# Altium schematic sheet Sheet1.SchDoc
size A4
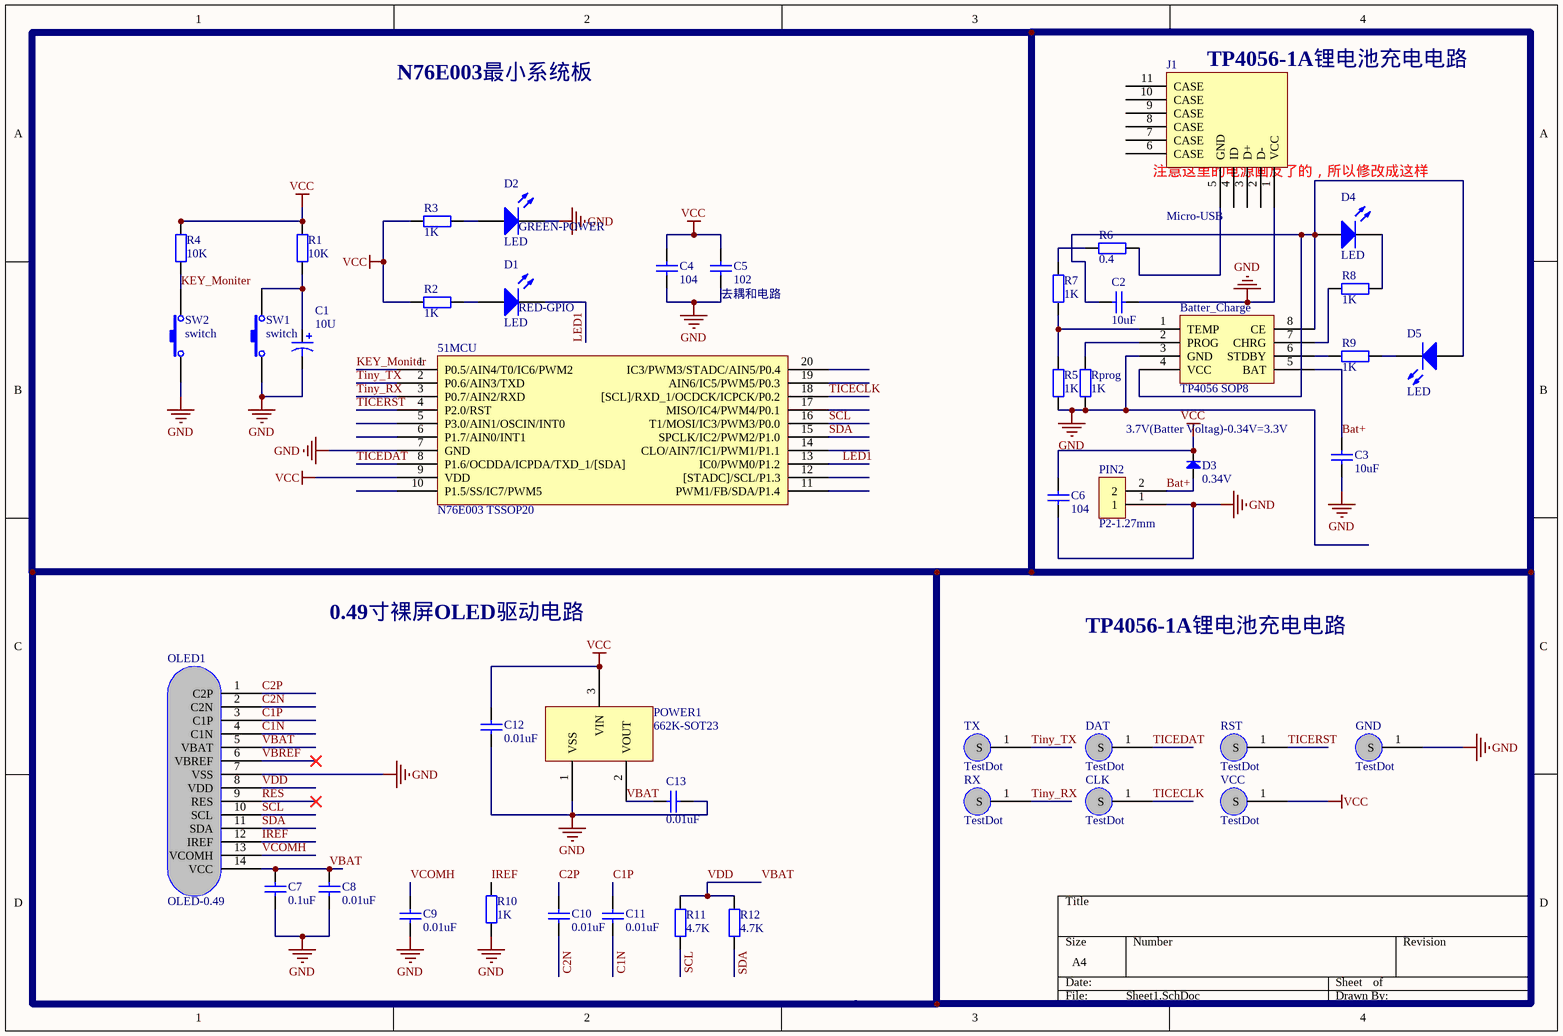
[diagram p0: Sheet1.SchDoc]

## Parts
51MCU  N76E003 TSSOP20  [TSSOP20]
Batter_Charge  TP4056 SOP8  [SOP8]
C1  10U  [0805P]
C2  10uF  [0603C]
C3  10uF  [0603C]
C4  104  [0603C]
C5  102  [0603C]
C6  104  [0603C]
C7  0.1uF  [CAP_0402_SMD]
C8  0.01uF  [CAP_0402_SMD]
C9  0.01uF  [CAP_0402_SMD]
C10  0.01uF  [CAP_0402_SMD]
C11  0.01uF  [CAP_0402_SMD]
C12  0.01uF  [CAP_0402_SMD]
C13  0.01uF  [CAP_0402_SMD]
CLK  TestDot  [Single-Dot]
D1  LED  [0805P]
D2  LED  [0805P]
D3  0.34V  [1206D]
D4  LED  [0805P]
D5  LED  [0805P]
DAT  TestDot  [Single-Dot]
GND  TestDot  [Single-Dot]
J1  Micro-USB  [Micro-USB]
OLED1  OLED-0.49  [OLED-0.49]
PIN2  P2-1.27mm  [Pin2-1.27mm]
POWER1  662K-SOT23  [SOT-23]
R1  10K  [RES_0402_SMD]
R2  1K  [RES_0402_SMD]
R3  1K  [RES_0402_SMD]
R4  10K  [RES_0402_SMD]
R5  1K  [0402]
R6  0.4  [0402]
R7  1K  [0402]
R8  1K  [0402]
R9  1K  [0402]
R10  1K  [RES_0402_SMD]
R11  4.7K  [RES_0402_SMD]
R12  4.7K  [RES_0402_SMD]
Rprog  1K  [0402]
RST  TestDot  [Single-Dot]
RX  TestDot  [Single-Dot]
SW1  switch  [SWITCH-微型]
SW2  switch  [SWITCH-微型]
TX  TestDot  [Single-Dot]
VCC  TestDot  [Single-Dot]

## Nets
GND: 51MCU.7(GND) Batter_Charge.3(GND) C1.2 C2.2 C3.1 C4.1 C5.1 C6.1 C7.1 C8.2 C9.2 C12.2 C13.2 D2.2(K) GND.1(S) J1.1(VCC) OLED1.7(VSS) PIN2.1 POWER1.1(VSS) R5.1 R10.1 Rprog.1 SW1.1 SW2.1
VCC: 51MCU.9(VDD) C4.2 C5.2 C6.2 C12.1 D3.2(K) POWER1.3(VIN) R1.2 R2.2 R3.2 R4.2 VCC.1(S)
Bat+: Batter_Charge.5(BAT) C3.2 D3.1(A) PIN2.2
C1N: C11.2 OLED1.4(C1N)
C1P: C11.1 OLED1.3(C1P)
C2N: C10.2 OLED1.2(C2N)
C2P: C10.1 OLED1.1(C2P)
IREF: OLED1.12(IREF) R10.2
KEY_Moniter: 51MCU.1(P0.5/AIN4/T0/IC6/PWM2) R4.1 SW2.2
LED1: 51MCU.13(IC0/PWM0/P1.2) D1.2(K)
RES: OLED1.9(RES)
SCL: 51MCU.16(T1/MOSI/IC3/PWM3/P0.0) OLED1.10(SCL) R11.1
SDA: 51MCU.15(SPCLK/IC2/PWM2/P1.0) OLED1.11(SDA) R12.1
TICECLK: 51MCU.18([SCL]/RXD_1/OCDCK/ICPCK/P0.2) CLK.1(S)
TICEDAT: 51MCU.8(P1.6/OCDDA/ICPDA/TXD_1/[SDA]) DAT.1(S)
TICERST: 51MCU.4(P2.0/RST) RST.1(S)
Tiny_RX: 51MCU.3(P0.7/AIN2/RXD) RX.1(S)
Tiny_TX: 51MCU.2(P0.6/AIN3/TXD) TX.1(S)
VBAT: C7.2 C8.1 C13.1 OLED1.5(VBAT) OLED1.8(VDD) OLED1.14(VCC) POWER1.2(VOUT) R11.2 R12.2  [also labelled VDD]
VBREF: OLED1.6(VBREF)
VCOMH: C9.1 OLED1.13(VCOMH)
NetBatter_Charge_1: Batter_Charge.1(TEMP) R5.2 R7.2
NetBatter_Charge_2: Batter_Charge.2(PROG) Rprog.2
NetBatter_Charge_4: Batter_Charge.4(VCC) Batter_Charge.8(CE) C2.1 D4.1(A) D5.1(A)
NetBatter_Charge_6: Batter_Charge.6(STDBY) R9.1
NetBatter_Charge_7: Batter_Charge.7(CHRG) R8.1
NetC1_1: C1.1 R1.1 SW1.2
NetD1_1: D1.1(A) R2.1
NetD2_1: D2.1(A) R3.1
NetD4_2: D4.2(K) R8.2
NetD5_2: D5.2(K) R9.2
NetJ1_5: J1.5(GND) R6.1
NetR6_2: R6.2 R7.1

Not connected (* = marked no-connect by the designer): 51MCU 5(P3.0/AIN1/OSCIN/INT0) 6(P1.7/AIN0/INT1) 10(P1.5/SS/IC7/PWM5) 11(PWM1/FB/SDA/P1.4) 12([STADC]/SCL/P1.3) 14(CLO/AIN7/IC1/PWM1/P1.1) 17(MISO/IC4/PWM4/P0.1) 19(AIN6/IC5/PWM5/P0.3) 20(IC3/PWM3/STADC/AIN5/P0.4); J1 2(D-) 3(D+) 4(ID) 6(CASE) 7(CASE) 8(CASE) 9(CASE) 10(CASE) 11(CASE)

## Notes on the sheet
- N76E003最小系统板
- (near J1) TP4056-1A锂电池充电电路
- (near J1) 注意这里的电源画反了的，所以修改成这样
- (near D2) GREEN-POWER
- (near D1) RED-GPIO
- (near C5) 去耦和电路
- 3.7V(Batter Voltag)-0.34V=3.3V
- 0.49寸裸屏OLED驱动电路
- TP4056-1A锂电池充电电路

## Library data of the parts
C1 = cap(polarity): value: 10uF
C2 C3 = cap: value: 10uF
C4-C6 = cap: value: 10uF
C7-C13 = Cap: Capacitor; Manufacturer: Generic Components; Class: Passive; Value: 100pF; Published: 08/06/2000; Publisher: Altium Hobart Technology Centre; SubClass: Capacitor
D3 = Diode Zener 稳压
R1-R4 R10-R12 = Res2: Resistor; Manufacturer: Generic Components; Class: Passive; Value: 4K7; Published: 08/06/2000; Publisher: Altium Hobart Technology Centre; SubClass: Resistor
R5 R7-R9 Rprog = resistor: small resistor; value: 1K
R6 = resistor: small resistor; value: 1K
SW1 SW2 = switch-1